# Altium schematic sheet SENSORS.SchDoc
size A4; SheetNumber: 4; SheetTotal: 7
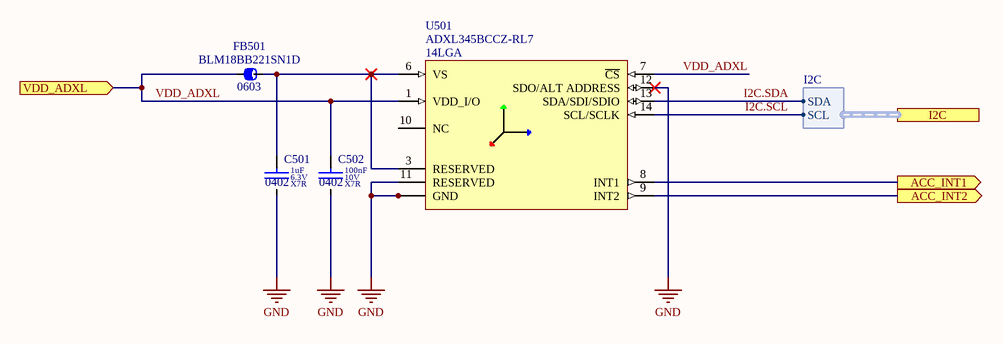
[diagram p0: SENSORS.SchDoc]

## Parts
C501  value 1uF  Dielectric: X7R  Voltage: 6.3V  SCH_Footprint: 0402  [C_0402_1005]  (hidden comment: Ceramic X7R)
C502  value 100nF  Dielectric: X7R  Voltage: 10V  SCH_Footprint: 0402  [C_0402_1005]  (hidden comment: Ceramic X7R)
FB501  value BLM18BB221SN1D  SCH_Footprint: 0603  [FB_0603_1608]  (hidden comment: Ferrite bead)
U501  value ADXL345BCCZ-RL7  SCH_Footprint: 14LGA  [LGA14_3x5]  (hidden comment: ADXL345BCCZ-RL7 Analog Devices Accelerometer X, Y, Z Axis 14LGA RoHS)

## Ports
ACC_INT1 (out, see PERIPHERALS[4C], nRF52833[3A], PERIPHERALS[4C]), ACC_INT2 (out, see PERIPHERALS[4C], nRF52833[3A], PERIPHERALS[4C]), I2C (harness I2C, see PERIPHERALS[4D], nRF52833[4C], PERIPHERALS[4D]), VDD_ADXL (in, see PERIPHERALS[4C], nRF52833[3B], PERIPHERALS[4C])

## Harnesses
I2C: SDA, SCL

## Nets
GND: C501.2 C502.2 U501.2(GND) U501.4(GND) U501.5(GND) U501.11(RESERVED) U501.12(SDO/ALT_ADDRESS)
ACC_INT1: U501.8(INT1) ; port ACC_INT1
ACC_INT2: U501.9(INT2) ; port ACC_INT2
I2C.SCL: U501.14(SCL/SCLK)
I2C.SDA: U501.13(SDA/SDI/SDIO)
VDD_ADXL: C502.1 FB501.1 U501.1(VDD_I/O) U501.7(~{CS}) ; port VDD_ADXL
NetC501_1: C501.1 FB501.2 U501.3(RESERVED) U501.6(VS)

Not connected (* = marked no-connect by the designer): U501 10(NC)

## Notes on the sheet
- Title:
- Sheet:
- of
- Author:
- Model:
- Document Number:
- Checked by:
- Iss-Rev:
- Approved by:
- Date:
- File name:

## Library data of the parts
C501 = C_1uF_6.3V_X7R_0402_10: Capacitor; Manufacturer: Murata; Manufacturer Part Number: GRM155R70J105KA12D; Tolerance (%): 10; Part Number: C_1uF_6.3V_X7R_0402_10; HelpURL: https://www.mouser.com/ds/2/281/c02e-2905.pdf; Supplier 1: TME; Supplier 2: RS Components; Supplier 3: Farnell; Supplier 4: Mouser; Supplier Part Number 4: 81-GRM155R70J105KA2D; Supplier 5: Digi-Key; Supplier 6: LCSC
C502 = C_100nF_10V_X7R_0402_10: Capacitor; Manufacturer: Murata; Manufacturer Part Number: GRM155R71A104KA01D; Tolerance (%): 10; Part Number: C_100nF_10V_X7R_0402_10; HelpURL: https://octopart.com/datasheet/grm155r71a104ka01d-murata-6810561; Supplier 1: TME; Supplier Part Number 1: GRM155R71A104KA01D; Supplier 2: RS Components; Supplier 3: Farnell; Supplier Part Number 3: 1828860; Supplier 4: Mouser; Supplier Part Number 4: 81-GRM155R71A104KA1D; Supplier 5: Digi-Key; Supplier Part Number 5: 490-6321-1-ND; Supplier 6: LCSC
FB501 = FB_BLM18BB221SN1D: Manufacturer: Murata; Current: 200mA; Resistance: 650mR; Part Number: FB_BLM18BB221SN1D; HelpURL: https://octopart.com/datasheet/blm18bb221sn1d-murata-118121; Manufacturer Part Number: BLM18BB221SN1D; Supplier 1: TME; Supplier Part Number 1: BLM18BB221SN1D; Supplier 2: RS Components; Supplier Part Number 2: 724-1302; Supplier 3: Farnell; Supplier Part Number 3: 1515695; Supplier 4: Mouser; Supplier Part Number 4: 81-BLM18BB221SN1D; Supplier 5: Digi-Key; Supplier Part Number 5: 490-5210-1-ND; Supplier 6: LCSC
U501 = U_ADXL345BCCZ-RL7: Part Number: U_ADXL345BCCZ-RL7; HelpURL: https://www.analog.com/media/en/technical-documentation/data-sheets/adxl345.pdf; Manufacturer: Analog Devices; Manufacturer Part Number: ADXL345BCCZ-RL7; Supplier 1: TME; Supplier 2: RS Components; Supplier 3: Farnell; Supplier 4: Mouser; Supplier Part Number 4: 584-ADXL345BCCZ-R7; Supplier 5: Digi-Key; Supplier Part Number 5: 505-ADXL345BCCZ-RL7CT-ND; Supplier 6: LCSC